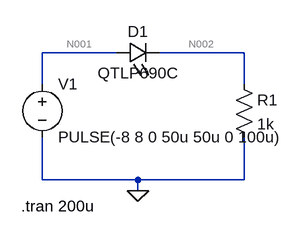
[diagram p0: schematic tran.asc]
tran.asc, the LTspice schematic file:
Version 4
SHEET 1 880 680
WIRE 160 96 48 96
WIRE 352 96 224 96
WIRE 48 144 48 96
WIRE 352 144 352 96
WIRE 48 288 48 224
WIRE 192 288 48 288
WIRE 352 288 352 224
WIRE 352 288 192 288
WIRE 192 304 192 288
FLAG 192 304 0
SYMBOL res 336 128 R0
SYMATTR InstName R1
SYMATTR Value 1k
SYMBOL LED 160 112 R270
WINDOW 0 32 32 VTop 2
WINDOW 3 0 32 VBottom 2
SYMATTR InstName D1
SYMATTR Value QTLP690C
SYMATTR Description Diode
SYMATTR Type diode
SYMBOL voltage 48 128 R0
WINDOW 123 0 0 Left 0
WINDOW 39 0 0 Left 0
SYMATTR InstName V1
SYMATTR Value PULSE(-8 8 0 50u 50u 0 100u)
TEXT 16 328 Left 2 !.tran 200u

The netlist it stands for:
* tran.asc
R1 N002 0 1k
D1 N001 N002 QTLP690C
V1 N001 0 PULSE(-8 8 0 50u 50u 0 100u)
.model D D
.lib standard.dio
.tran 200u
.backanno
.end

* Results of the author's LTspice run, read from the files saved beside the schematic
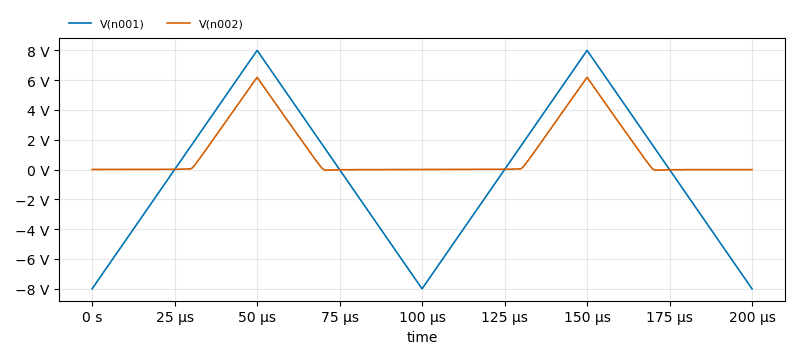
[diagram p1: Transient Analysis of tran.asc, plotted from the saved traces]
* Transient Analysis, 1 run:
*   V(n001): min -8 V, max 7.994 V, average -367.6 µV, rms 4.674 V, last -8 V
*   V(n002): min -41.54 mV, max 6.189 V, average 1.222 V, rms 2.318 V, last -5.336 mV